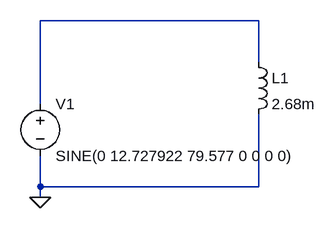
[diagram p0: schematic scheme4.asc]
scheme4.asc, the LTspice schematic file:
Version 4
SHEET 1 880 680
WIRE 496 -16 160 -16
WIRE 496 48 496 -16
WIRE 160 112 160 -16
WIRE 160 240 160 192
WIRE 496 240 496 128
WIRE 496 240 160 240
WIRE 160 256 160 240
FLAG 160 256 0
SYMBOL voltage 160 96 R0
WINDOW 123 0 0 Left 0
WINDOW 39 0 0 Left 0
SYMATTR InstName V1
SYMATTR Value SINE(0 12.727922 79.577 0 0 0 0)
SYMBOL ind 480 32 R0
SYMATTR InstName L1
SYMATTR Value 2.68m

The netlist it stands for:
* scheme4.asc
V1 N001 0 SINE(0 12.727922 79.577 0 0 0 0)
L1 N001 0 2.68m
.backanno
.end